# Altium project Data_Transmission_Panel.PrjPcb
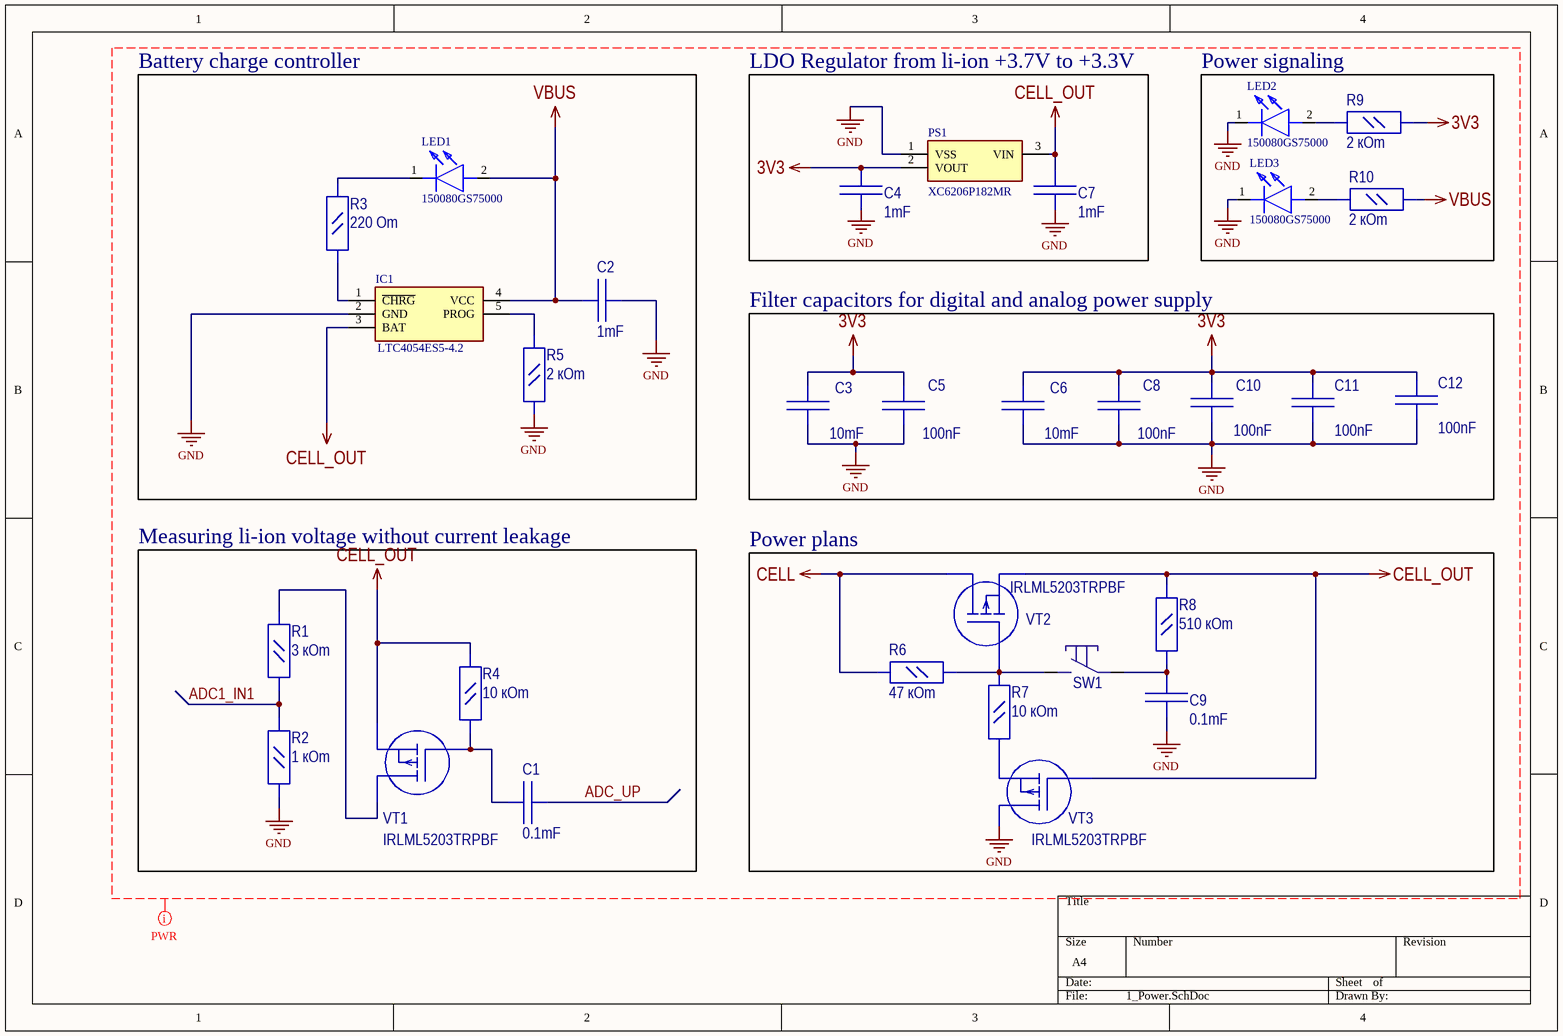
[diagram p0: 1_Power.SchDoc]
5 sheets, 88 parts. Net scope: global (net labels, ports and power ports of the same name join across sheets).
Board file: Panel.PcbDoc
Sheets:
  1_Power.SchDoc
  2_Sensors.SchDoc
  3_Connectors.SchDoc
  4_MCU.SchDoc
  5_Keyboard.SchDoc

## Sheet 1_Power.SchDoc
size A4

### Parts
(Parts that share a designator on the sheet are numbered #1, #2 ... from top to bottom, then left to right.)
C1  0.1mF  [C_0805]
C2  1mF  [C_0805]
C3  10mF  [C_0805]
C4  1mF  [C_0805]
C5  100nF  [C_0805]
C6  10mF  [C_0805]
C7  1mF  [C_0805]
C8  100nF  [C_0805]
C9  0.1mF  [C_0805]
C10  100nF  [C_0805]
C11  100nF  [C_0805]
C12  100nF  [C_0805]
IC1  LTC4054ES5-4.2  [SOT95P280X100-5N]
LED1  150080GS75000  [LEDM2012X80N]
LED2  150080GS75000  [LEDM2012X80N]
LED3  150080GS75000  [LEDM2012X80N]
PS1  XC6206P182MR  [SOT95P280X130-3N]
R1  3 кOm  [R_0805]
R2  1 кOm  [R_0805]
R3  220 Om  [R_0805]
R4  10 кOm  [R_0805]
R5  2 кOm  [R_0805]
R6  47 кOm  [R_0805]
R7  10 кOm  [R_0805]
R8  510 кOm  [R_0805]
R9  2 кOm  [R_0805]
R10  2 кOm  [R_0805]
SW1#1  KLS7-TS6604  [KLS7-TS6604-5.0-180-B]  (value not drawn)
VT1  IRLML5203TRPBF  [SOT23]
VT2  IRLML5203TRPBF  [SOT23]
VT3  IRLML5203TRPBF  [SOT23]

### Blocks framed on the sheet
Battery charge controller: C2 IC1 LED1 R3 R5
LDO Regulator from li-ion +3.7V to +3.3V: C4 C7 PS1
Power signaling: LED2 LED3 R9 R10
Filter capacitors for digital and analog power supply: C3 C5 C6 C8 C10-C12
Measuring li-ion voltage without current leakage: C1 R1 R2 R4 VT1
Power plans: C9 R6-R8 SW1#1 VT2 VT3

### Nets
3V3: C3.2 C4.2 C5.2 C6.2 C8.2 C10.2 C11.2 C12.2 PS1.2(VOUT) R9.1
CELL: R6.2 VT2.3(D)
CELL_OUT: C7.2 IC1.3(BAT) PS1.3(VIN) R4.2 R8.2 VT1.2(S) VT2.2(S) VT3.1(G)
GND: C2.2 C3.1 C4.1 C5.1 C6.1 C7.1 C8.1 C9.1 C10.1 C11.1 C12.1 IC1.2(GND) LED2.1(K) LED3.1(K) PS1.1(VSS) R2.1 R5.1
VBUS: C2.1 IC1.4(VCC) LED1.2(A) R10.1
ADC1_IN1: R1.1 R2.2
ADC_UP: C1.1
NetC1_2: C1.2 R4.1 VT1.1(G)
NetC9_2: C9.2 R8.1 SW1#1.2
NetIC1_1: IC1.1(~{CHRG}) R3.1
NetIC1_5: IC1.5(PROG) R5.2
NetLED1_1: LED1.1(K) R3.2
NetLED2_2: LED2.2(A) R9.2
NetLED3_2: LED3.2(A) R10.2
NetR1_2: R1.2 VT1.3(D)
NetR6_1: R6.1 R7.2 SW1#1.1 VT2.1(G)
NetR7_1: R7.1 VT3.2(S)

Not connected (* = marked no-connect by the designer): VT3 3(D)

### Layout directives
net class PWR: 3V3, ADC1_IN1, ADC_UP, CELL, CELL_OUT, GND, VBUS

### Notes on the sheet
- Labels drawn without touching a wire or pin: GND

### Library data of the parts
C1-C12 = C_0805
  C1 C9: Value: 0.1mF
  C2 C4 C7: Value: 1mF
  C3 C6: Value: 10mF
  C5 C8 C10-C12: Value: 100nF
IC1 = LTC4054ES5-4.2: Integrated Circuit; Manufacturer_Name: Linear Technology; Datasheet Link: https://componentsearchengine.com/Datasheets/1/LTC4054ES5-4.2.pdf; Height: 1mm; Manufacturer_Part_Number: LTC4054ES5-4.2; Mouser Part Number: 584-LTC4054ES5-4.2; Mouser Price/Stock: https://www.mouser.com/Search/Refine.aspx?Keyword=584-LTC4054ES5-4.2
LED1-LED3 = 150080GS75000: LED; Manufacturer_Name: Wurth Elektronik; Datasheet Link: https://katalog.we-online.com/led/datasheet/150080GS75000.pdf; Height: 0.8mm; Manufacturer_Part_Number: 150080GS75000; Mouser Part Number: 710-150080GS75000; Mouser Price/Stock: https://www.mouser.co.uk/ProductDetail/Wurth-Elektronik/150080GS75000?qs=2kOmHSv6VfQRoTEZVk1mGA%3D%3D
PS1 = XC6206P182MR: Power Supply; Manufacturer_Name: Torex; Datasheet Link: https://componentsearchengine.com/Datasheets/2/XC6206P182MR.pdf; Height: 1.3mm; Manufacturer_Part_Number: XC6206P182MR
R1 R4 R7 = R_0805: Value: 10 kOm
R2 = R_0805: Value: 1 kOm
R3 = R_0805: Value: 220 Om
R5 R9 R10 = R_0805: Value: 2 kOm
R6 = R_0805: Value: 47 kOm
R8 = R_0805: Value: 510 kOm
VT1-VT3 = IRLML5203TRPBF: Транзистор, P-канал 30В 3A logic

## Sheet 2_Sensors.SchDoc
size A4
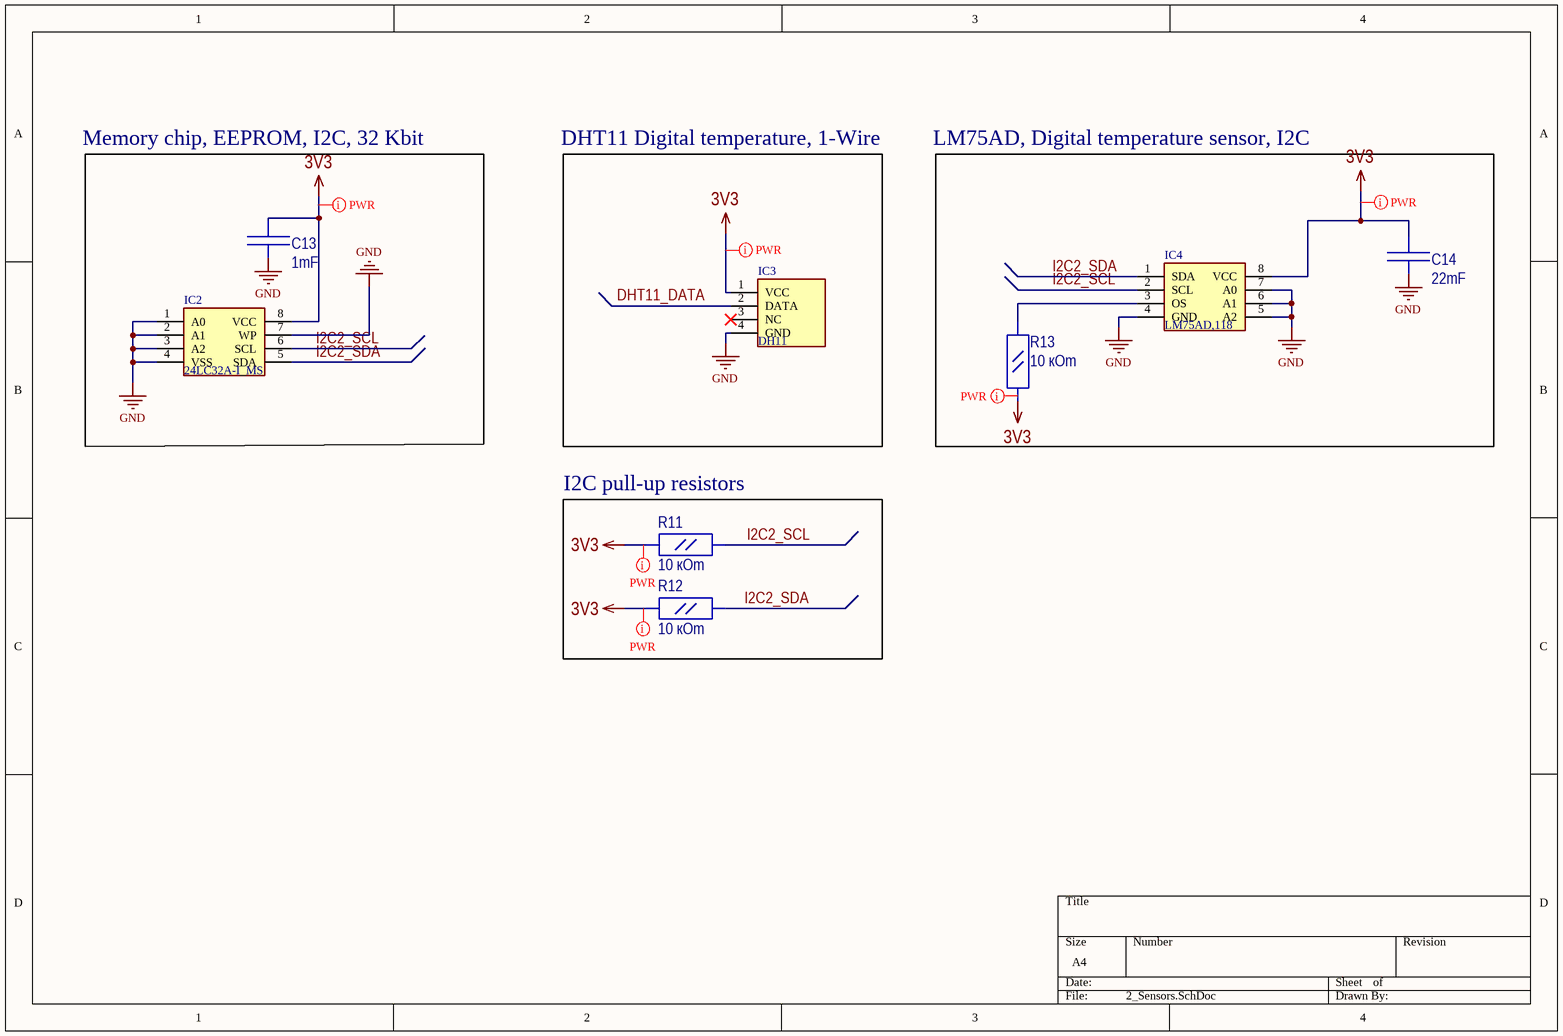
[diagram p1: 2_Sensors.SchDoc]

### Parts
C13  1mF  [C_0805]
C14  22mF  [C_0805]
IC2  24LC32A-I_MS  [SOP65P490X110-8N]
IC3  DH11  [HDRV4W80P0X254_1X4_1200X500X1550P]
IC4  LM75AD,118  [SOIC127P600X175-8N]
R11  10 кOm  [R_0805]
R12  10 кOm  [R_0805]
R13  10 кOm  [R_0805]

### Blocks framed on the sheet
Memory chip, EEPROM, I2C, 32 Kbit: C13 IC2
DHT11 Digital temperature, 1-Wire: IC3
LM75AD, Digital temperature sensor, I2C: C14 IC4 R13
I2C pull-up resistors: R11 R12

### Nets
3V3: C13.2 C14.2 IC2.8(VCC) IC3.1(VCC) IC4.8(VCC) R11.1 R12.1 R13.1
GND: IC2.1(A0) IC2.2(A1) IC2.3(A2) IC2.4(VSS) IC2.7(WP) IC3.4(GND) IC4.4(GND) IC4.5(A2) IC4.6(A1) IC4.7(A0)
DHT11_DATA: IC3.2(DATA)
I2C2_SCL: IC2.6(SCL) IC4.2(SCL) R11.2
I2C2_SDA: IC2.5(SDA) IC4.1(SDA) R12.2
NetIC4_3: IC4.3(OS) R13.2

Not connected (* = marked no-connect by the designer): C13 1; C14 1; IC3 3(NC)*

### Layout directives
net class PWR: 3V3, (no net found under the mark)

### Notes on the sheet
- Labels drawn without touching a wire or pin: GND

### Library data of the parts
C13 C14 = C_0805
  C13: Value: 1mF
  C14: Value: 22mF
IC2 = 24LC32A-I_MS: Integrated Circuit; Manufacturer_Name: Microchip; Manufacturer_Part_Number: 24LC32A-I/MS; Datasheet Link: http://ww1.microchip.com/downloads/en/DeviceDoc/21713M.pdf; Height: 1.1mm; Mouser Part Number: 579-24LC32A-I/MS; Mouser Price/Stock: https://www.mouser.co.uk/ProductDetail/Microchip-Technology/24LC32A-I-MS?qs=KwArPi4cUogzTH4kJR6iUQ%3D%3D; Arrow Part Number: 24LC32A-I/MS; Arrow Price/Stock: https://www.arrow.com/en/products/24lc32a-ims/microchip-technology
IC3 = 101020011: Integrated Circuit; Manufacturer_Name: Seeed Studio; Datasheet Link: https://componentsearchengine.com/Datasheets/1/101020011.pdf; Height: 15.5mm; Manufacturer_Part_Number: 101020011; Mouser Part Number: 713-101020011; Mouser Price/Stock: https://www.mouser.co.uk/ProductDetail/Seeed-Studio/101020011?qs=1%252B9yuXKSi8Dq%252B99bte6U5Q%3D%3D; Arrow Part Number: 101020011; Arrow Price/Stock: https://www.arrow.com/en/products/101020011/seeed-technology-limited
IC4 = LM75AD,118: Integrated Circuit; Manufacturer_Name: NXP; Datasheet Link: http://www.nxp.com/docs/en/data-sheet/LM75A.pdf; Height: 1.75mm; Manufacturer_Part_Number: LM75AD,118; Mouser Part Number: 771-LM75AD-T; Mouser Price/Stock: https://www.mouser.co.uk/ProductDetail/NXP-Semiconductors/LM75AD118?qs=LOCUfHb8d9tvtApDiOTqqg%3D%3D; Arrow Part Number: LM75AD,118; Arrow Price/Stock: https://www.arrow.com/en/products/lm75ad118/nxp-semiconductors?region=nac
R11-R13 = R_0805: Value: 10 kOm

## Sheet 3_Connectors.SchDoc
size A4
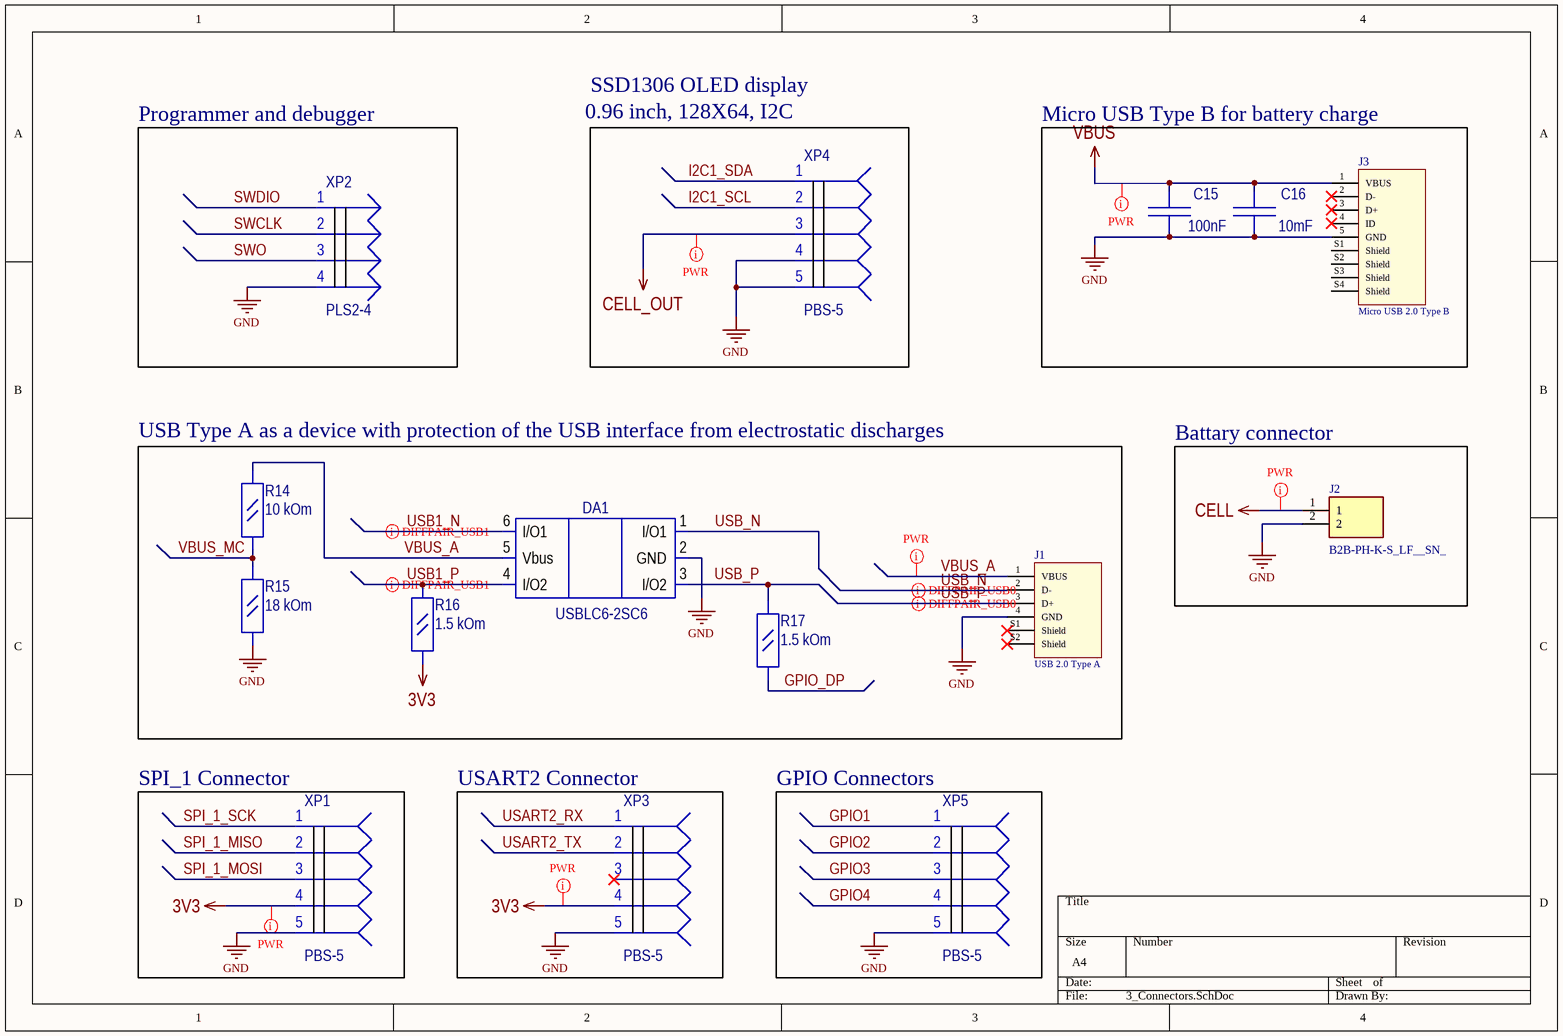
[diagram p2: 3_Connectors.SchDoc]

### Parts
(Parts that share a designator on the sheet are numbered #1, #2 ... from top to bottom, then left to right.)
C15  100nF  [C_0805]
C16  10mF  [C_0805]
DA1  USBLC6-2SC6  [SOT-23-6]
J1  USB 2.0 Type A  [61400416021]
J2  B2B-PH-K-S_LF__SN_  [SHDR2W50P0X200_1X2_590X450X600P]
J3  Micro USB 2.0 Type B  [629105136821]
R14  10 kOm  [R_0805]
R15  18 kOm  [R_0805]
R16  1.5 kOm  [R_0805]
R17#1  1.5 kOm  [R_0805]
XP1  PBS-5  [PBS-5]
XP2  PLS2-4  [PLS2-4]
XP3  PBS-5  [PBS-5]
XP4  PBS-5  [PBS-5]
XP5  PBS-5  [PBS-5]

### Blocks framed on the sheet
Programmer and debugger: XP2
Micro USB Type B for battery charge: C15 C16 J3
Battary connector: J2
SPI_1 Connector: XP1
USART2 Connector: XP3
GPIO Connectors: XP5

### Nets
3V3: R16.1 XP1.4 XP3.4
CELL: J2.1
CELL_OUT: XP4.3
GND: C15.1 C16.1 DA1.2(GND) J1.4(GND) J2.2 J3.5(GND) R15.1 XP1.5 XP2.4 XP3.5 XP4.4 XP4.5 XP5.5
VBUS: C15.2 C16.2 J3.1(VBUS)
GPIO1: XP5.1
GPIO2: XP5.2
GPIO3: XP5.3
GPIO4: XP5.4
GPIO_DP: R17#1.1
I2C1_SCL: XP4.2
I2C1_SDA: XP4.1
SPI_1_MISO: XP1.2
SPI_1_MOSI: XP1.3
SPI_1_SCK: XP1.1
SWCLK: XP2.2
SWDIO: XP2.1
SWO: XP2.3
USART2_RX: XP3.1
USART2_TX: XP3.2
USB1_N: DA1.6(I/O1)
USB1_P: DA1.4(I/O2) R16.2
USB_N: DA1.1(I/O1) J1.2(D-)
USB_P: DA1.3(I/O2) J1.3(D+) R17#1.2
VBUS_A: DA1.5(Vbus) J1.1(VBUS) R14.2
VBUS_MC: R14.1 R15.2

Not connected (* = marked no-connect by the designer): J1 S1(Shield)* S2(Shield)*; J3 2(D-)* 3(D+)* 4(ID)* S1(Shield) S2(Shield) S3(Shield) S4(Shield); XP3 3*

### Layout directives
differential pair; differential pair class USB1: USB1_N, USB1_P
differential pair; differential pair class USB0: USB_N, USB_P
net class PWR: 3V3, CELL, CELL_OUT, VBUS, VBUS_A

### Notes on the sheet
- SSD1306 OLED display
- 0.96 inch, 128X64, I2C
- (near R14) USB Type A as a device with protection of the USB interface from electrostatic discharges

### Library data of the parts
C15 C16 = C_0805
  C15: Value: 100nF
  C16: Value: 10mF
J1 = 61400416021: USB 2.0 Type A Horizontal THT WR-COM; Rated Current: 1.5 A; Gender: Female; ComponentLink1Description: Manufacturer; ComponentLink1URL: http://www.we-online.de; ComponentLink2Description: Datasheet; ComponentLink2URL: http://katalog.we-online.de/em/datasheet/61400416021.pdf; Part Number: 61400416021; Published Date: May 2018; Publisher: Wurth Elektronik; Orientation: Horizontal; Interface Type: USB 2.0 Type A; Operating Temperature: -40 to 105 degC; Mounting Technology: THT; Packaging: Tray
J2 = B2B-PH-K-S_LF__SN_: Connector; Manufacturer_Name: JST (JAPAN SOLDERLESS TERMINALS); Manufacturer_Part_Number: B2B-PH-K-S(LF)(SN); Datasheet Link: https://datasheet.lcsc.com/szlcsc/JST-Sales-America-B2B-PH-K-S-LF-SN_C131337.pdf; Height: 6mm; Arrow Part Number: B2B-PH-K-S(LF)(SN); Arrow Price/Stock: https://www.arrow.com/en/products/b2b-ph-k-s-lf-sn/jst-manufacturing
J3 = 629105136821: Micro USB 2.0 Type B Horizontal SMT 5 Contacts WR-COM; Rated Current: 1 A; Gender: Female; ComponentLink1Description: Manufacturer; ComponentLink1URL: http://www.we-online.de; ComponentLink2Description: Datasheet; ComponentLink2URL: http://katalog.we-online.de/em/datasheet/629105136821.pdf; Part Number: 629105136821; Published Date: May 2018; Publisher: Wurth Elektronik; Orientation: Horizontal; Interface Type: Micro USB 2.0 Type B; Operating Temperature: -40 to 85 degC; Mounting Technology: SMT; Packaging: Tape and Reel
R14 = R_0805: Value: 10 кOm
R15 R16 R17#1 = R_0805
  R15: Value: 18 kOm
  R16 R17#1: Value: 1.5 kOm
DA1 = USBLC6-2SC6: HelpURL: https://static.chipdip.ru/lib/093/DOC001093117.pdf

## Sheet 4_MCU.SchDoc
size A3
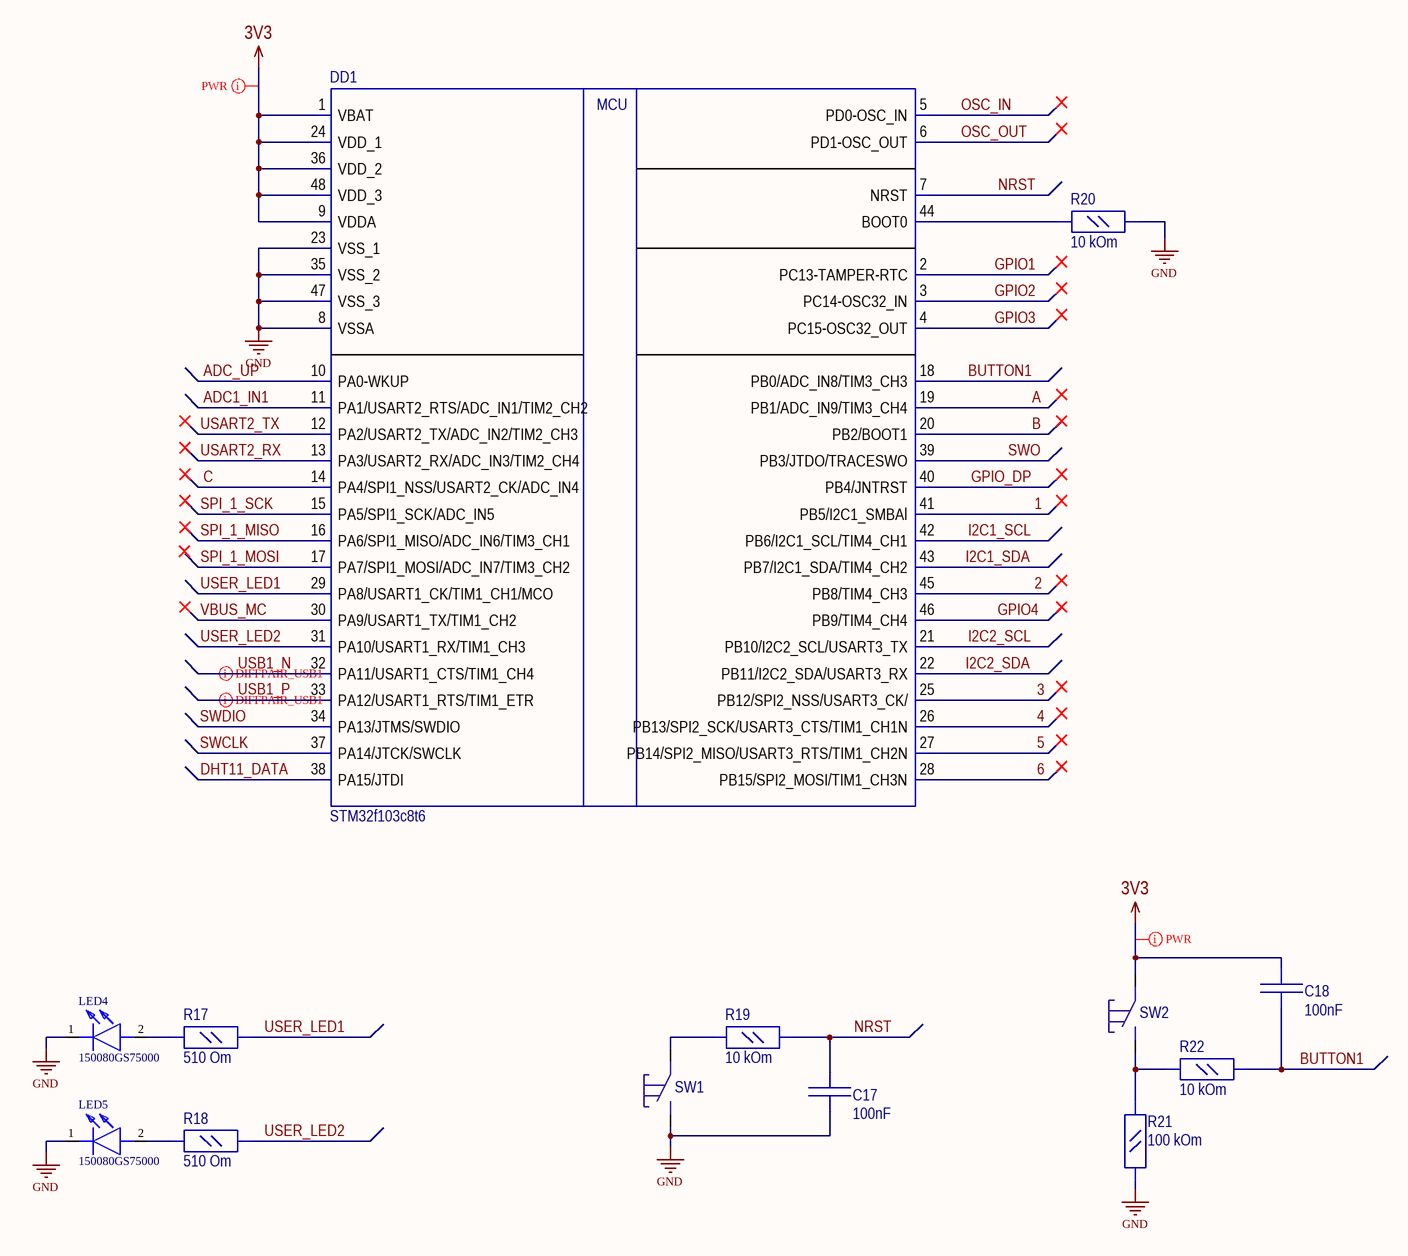
[diagram p3: 4_MCU.SchDoc]

### Parts
(Parts that share a designator on the sheet are numbered #1, #2 ... from top to bottom, then left to right.)
C17  100nF  [C_0805]
C18  100nF  [C_0805]
DD1  STM32f103c8t6  [LQFP48]
LED4  150080GS75000  [LEDM2012X80N]
LED5  150080GS75000  [LEDM2012X80N]
R17#2  510 Om  [R_0805]
R18  510 Om  [R_0805]
R19  10 kOm  [R_0805]
R20  10 kOm  [R_0805]
R21  100 kOm  [R_0805]
R22  10 kOm  [R_0805]
SW1#2  KLS7-TS6604  [KLS7-TS6604-5.0-180-B]  (value not drawn)
SW2  KLS7-TS6604  [KLS7-TS6604-5.0-180-B]  (value not drawn)

### Nets
3V3: C18.2 DD1.1(VBAT) DD1.9(VDDA) DD1.24(VDD_1) DD1.36(VDD_2) DD1.48(VDD_3) SW2.2
GND: C17.1 DD1.8(VSSA) DD1.23(VSS_1) DD1.35(VSS_2) DD1.47(VSS_3) LED4.1(K) LED5.1(K) R20.1 R21.2 SW1#2.1
1: DD1.41(PB5/I2C1_SMBAl)
2: DD1.45(PB8/TIM4_CH3)
3: DD1.25(PB12/SPI2_NSS/USART3_CK/)
4: DD1.26(PB13/SPI2_SCK/USART3_CTS/TIM1_CH1N)
5: DD1.27(PB14/SPI2_MISO/USART3_RTS/TIM1_CH2N)
6: DD1.28(PB15/SPI2_MOSI/TIM1_CH3N)
A: DD1.19(PB1/ADC_IN9/TIM3_CH4)
ADC1_IN1: DD1.11(PA1/USART2_RTS/ADC_IN1/TIM2_CH2)
ADC_UP: DD1.10(PA0-WKUP)
B: DD1.20(PB2/BOOT1)
BUTTON1: C18.1 DD1.18(PB0/ADC_IN8/TIM3_CH3) R22.1
C: DD1.14(PA4/SPI1_NSS/USART2_CK/ADC_IN4)
DHT11_DATA: DD1.38(PA15/JTDI)
GPIO1: DD1.2(PC13-TAMPER-RTC)
GPIO2: DD1.3(PC14-OSC32_IN)
GPIO3: DD1.4(PC15-OSC32_OUT)
GPIO4: DD1.46(PB9/TIM4_CH4)
GPIO_DP: DD1.40(PB4/JNTRST)
I2C1_SCL: DD1.42(PB6/I2C1_SCL/TIM4_CH1)
I2C1_SDA: DD1.43(PB7/I2C1_SDA/TIM4_CH2)
I2C2_SCL: DD1.21(PB10/I2C2_SCL/USART3_TX)
I2C2_SDA: DD1.22(PB11/I2C2_SDA/USART3_RX)
NRST: C17.2 DD1.7(NRST) R19.1
OSC_IN: DD1.5(PD0-OSC_IN)
OSC_OUT: DD1.6(PD1-OSC_OUT)
SPI_1_MISO: DD1.16(PA6/SPI1_MISO/ADC_IN6/TIM3_CH1)
SPI_1_MOSI: DD1.17(PA7/SPI1_MOSI/ADC_IN7/TIM3_CH2)
SPI_1_SCK: DD1.15(PA5/SPI1_SCK/ADC_IN5)
SWCLK: DD1.37(PA14/JTCK/SWCLK)
SWDIO: DD1.34(PA13/JTMS/SWDIO)
SWO: DD1.39(PB3/JTDO/TRACESWO)
USART2_RX: DD1.13(PA3/USART2_RX/ADC_IN3/TIM2_CH4)
USART2_TX: DD1.12(PA2/USART2_TX/ADC_IN2/TIM2_CH3)
USB1_N: DD1.32(PA11/USART1_CTS/TIM1_CH4)
USB1_P: DD1.33(PA12/USART1_RTS/TIM1_ETR)
USER_LED1: DD1.29(PA8/USART1_CK/TIM1_CH1/MCO) R17#2.1
USER_LED2: DD1.31(PA10/USART1_RX/TIM1_CH3) R18.1
VBUS_MC: DD1.30(PA9/USART1_TX/TIM1_CH2)
NetDD1_44: DD1.44(BOOT0) R20.2
NetLED4_2: LED4.2(A) R17#2.2
NetLED5_2: LED5.2(A) R18.2
NetR19_2: R19.2 SW1#2.2
NetR21_1: R21.1 R22.2 SW2.1

### Layout directives
differential pair; differential pair class USB1: USB1_N, USB1_P
net class PWR: 3V3

### Notes on the sheet
- Title
- Size:
- Date:
- A3
- Number:
- Time:
- Revision:
- Sheet
- of
- File:
- (in symbol STM32f103c8t6) MCU

### Library data of the parts
C17 C18 = C_0805: Value: 100nF
LED4 LED5 = 150080GS75000: LED; Manufacturer_Name: Wurth Elektronik; Datasheet Link: https://katalog.we-online.com/led/datasheet/150080GS75000.pdf; Height: 0.8mm; Manufacturer_Part_Number: 150080GS75000; Mouser Part Number: 710-150080GS75000; Mouser Price/Stock: https://www.mouser.co.uk/ProductDetail/Wurth-Elektronik/150080GS75000?qs=2kOmHSv6VfQRoTEZVk1mGA%3D%3D
R17#2 R18-R20 R22 = R_0805
  R17#2 R18: Value: 510 Om
  R19 R20 R22: Value: 10 kOm
R21 = R_0805: Value: 10 kOm

## Sheet 5_Keyboard.SchDoc
size A4
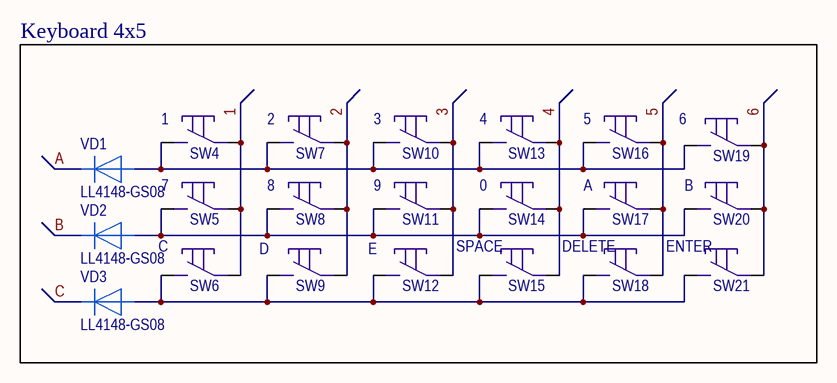
[diagram p4: 5_Keyboard.SchDoc]

### Parts
SW4  KLS7-TS6604  [KLS7-TS6604-5.0-180-B]  (value not drawn)
SW5  KLS7-TS6604  [KLS7-TS6604-5.0-180-B]  (value not drawn)
SW6  KLS7-TS6604  [KLS7-TS6604-5.0-180-B]  (value not drawn)
SW7  KLS7-TS6604  [KLS7-TS6604-5.0-180-B]  (value not drawn)
SW8  KLS7-TS6604  [KLS7-TS6604-5.0-180-B]  (value not drawn)
SW9  KLS7-TS6604  [KLS7-TS6604-5.0-180-B]  (value not drawn)
SW10  KLS7-TS6604  [KLS7-TS6604-5.0-180-B]  (value not drawn)
SW11  KLS7-TS6604  [KLS7-TS6604-5.0-180-B]  (value not drawn)
SW12  KLS7-TS6604  [KLS7-TS6604-5.0-180-B]  (value not drawn)
SW13  KLS7-TS6604  [KLS7-TS6604-5.0-180-B]  (value not drawn)
SW14  KLS7-TS6604  [KLS7-TS6604-5.0-180-B]  (value not drawn)
SW15  KLS7-TS6604  [KLS7-TS6604-5.0-180-B]  (value not drawn)
SW16  KLS7-TS6604  [KLS7-TS6604-5.0-180-B]  (value not drawn)
SW17  KLS7-TS6604  [KLS7-TS6604-5.0-180-B]  (value not drawn)
SW18  KLS7-TS6604  [KLS7-TS6604-5.0-180-B]  (value not drawn)
SW19  KLS7-TS6604  [KLS7-TS6604-5.0-180-B]  (value not drawn)
SW20  KLS7-TS6604  [KLS7-TS6604-5.0-180-B]  (value not drawn)
SW21  KLS7-TS6604  [KLS7-TS6604-5.0-180-B]  (value not drawn)
VD1  LL4148-GS08  [SOD-80]
VD2  LL4148-GS08  [SOD-80]
VD3  LL4148-GS08  [SOD-80]

### Nets
1: SW4.2 SW5.2 SW6.2
2: SW7.2 SW8.2 SW9.2
3: SW10.2 SW11.2 SW12.2
4: SW13.2 SW14.2 SW15.2
5: SW16.2 SW17.2 SW18.2
6: SW19.2 SW20.2 SW21.2
A: VD1.2
B: VD2.2
C: VD3.2
NetSW4_1: SW4.1 SW7.1 SW10.1 SW13.1 SW16.1 SW19.1 VD1.1
NetSW5_1: SW5.1 SW8.1 SW11.1 SW14.1 SW17.1 SW20.1 VD2.1
NetSW6_1: SW6.1 SW9.1 SW12.1 SW15.1 SW18.1 SW21.1 VD3.1

### Notes on the sheet
- Keyboard 4x5
- (near SW4) 1
- (near SW7) 2
- (near SW10) 3
- (near SW13) 4
- (near SW16) 5
- 6
- (near SW5) 7
- (near SW8) 8
- (near SW11) 9
- (near SW14) 0
- (near SW17) A
- (near SW20) B
- C
- D
- (near SW12) E
- SPACE
- DELETE
- ENTER

### Library data of the parts
VD1-VD3 = LL4148-GS08: Диод

## Nets that join several sheets
3V3: 1_Power (10 pins), 2_Sensors (8 pins), 3_Connectors (R16.1 XP1.4 XP3.4), 4_MCU (7 pins)
CELL: 1_Power (R6.2 VT2.3), 3_Connectors (J2.1)
CELL_OUT: 1_Power (8 pins), 3_Connectors (XP4.3)
GND: 1_Power (17 pins), 2_Sensors (10 pins), 3_Connectors (13 pins), 4_MCU (10 pins)
VBUS: 1_Power (C2.1 IC1.4 LED1.2 R10.1), 3_Connectors (C15.2 C16.2 J3.1)
1: 4_MCU (DD1.41), 5_Keyboard (SW4.2 SW5.2 SW6.2)
2: 4_MCU (DD1.45), 5_Keyboard (SW7.2 SW8.2 SW9.2)
3: 4_MCU (DD1.25), 5_Keyboard (SW10.2 SW11.2 SW12.2)
4: 4_MCU (DD1.26), 5_Keyboard (SW13.2 SW14.2 SW15.2)
5: 4_MCU (DD1.27), 5_Keyboard (SW16.2 SW17.2 SW18.2)
6: 4_MCU (DD1.28), 5_Keyboard (SW19.2 SW20.2 SW21.2)
A: 4_MCU (DD1.19), 5_Keyboard (VD1.2)
ADC1_IN1: 1_Power (R1.1 R2.2), 4_MCU (DD1.11)
ADC_UP: 1_Power (C1.1), 4_MCU (DD1.10)
B: 4_MCU (DD1.20), 5_Keyboard (VD2.2)
C: 4_MCU (DD1.14), 5_Keyboard (VD3.2)
DHT11_DATA: 2_Sensors (IC3.2), 4_MCU (DD1.38)
GPIO1: 3_Connectors (XP5.1), 4_MCU (DD1.2)
GPIO2: 3_Connectors (XP5.2), 4_MCU (DD1.3)
GPIO3: 3_Connectors (XP5.3), 4_MCU (DD1.4)
GPIO4: 3_Connectors (XP5.4), 4_MCU (DD1.46)
GPIO_DP: 3_Connectors (R17#1.1), 4_MCU (DD1.40)
I2C1_SCL: 3_Connectors (XP4.2), 4_MCU (DD1.42)
I2C1_SDA: 3_Connectors (XP4.1), 4_MCU (DD1.43)
I2C2_SCL: 2_Sensors (IC2.6 IC4.2 R11.2), 4_MCU (DD1.21)
I2C2_SDA: 2_Sensors (IC2.5 IC4.1 R12.2), 4_MCU (DD1.22)
SPI_1_MISO: 3_Connectors (XP1.2), 4_MCU (DD1.16)
SPI_1_MOSI: 3_Connectors (XP1.3), 4_MCU (DD1.17)
SPI_1_SCK: 3_Connectors (XP1.1), 4_MCU (DD1.15)
SWCLK: 3_Connectors (XP2.2), 4_MCU (DD1.37)
SWDIO: 3_Connectors (XP2.1), 4_MCU (DD1.34)
SWO: 3_Connectors (XP2.3), 4_MCU (DD1.39)
USART2_RX: 3_Connectors (XP3.1), 4_MCU (DD1.13)
USART2_TX: 3_Connectors (XP3.2), 4_MCU (DD1.12)
USB1_N: 3_Connectors (DA1.6), 4_MCU (DD1.32)
USB1_P: 3_Connectors (DA1.4 R16.2), 4_MCU (DD1.33)
VBUS_MC: 3_Connectors (R14.1 R15.2), 4_MCU (DD1.30)